# Altium schematic sheet laser_show_adc_uart.SchDoc
size A; Author: FHC
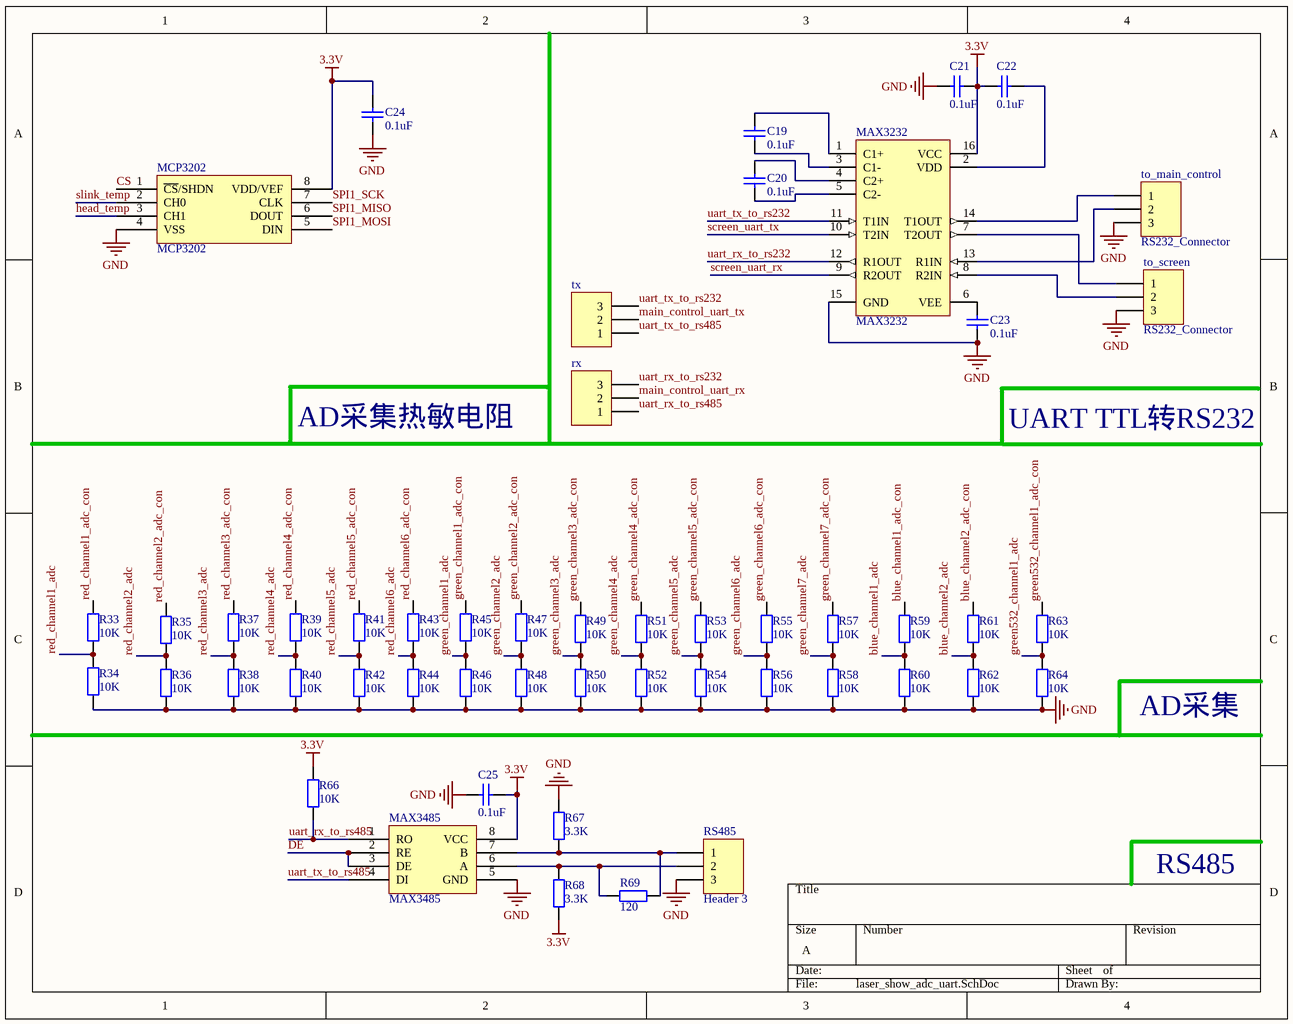
[diagram p0: laser_show_adc_uart.SchDoc]

## Parts
C19  0.1uF  [0603C]
C20  0.1uF  [0603C]
C21  0.1uF  [0603C]
C22  0.1uF  [0603C]
C23  0.1uF  [0603C]
C24  0.1uF  [0603C]
C25  0.1uF  [0603C]
MAX3232  MAX3232  [SO-16]
MAX3485  MAX3485  [so-8]
MCP3202  MCP3202  [SOIC8N_L]
R33  10K  [0805R]
R34  10K  [0805R]
R35  10K  [0805R]
R36  10K  [0805R]
R37  10K  [0805R]
R38  10K  [0805R]
R39  10K  [0805R]
R40  10K  [0805R]
R41  10K  [0805R]
R42  10K  [0805R]
R43  10K  [0805R]
R44  10K  [0805R]
R45  10K  [0805R]
R46  10K  [0805R]
R47  10K  [0805R]
R48  10K  [0805R]
R49  10K  [0805R]
R50  10K  [0805R]
R51  10K  [0805R]
R52  10K  [0805R]
R53  10K  [0805R]
R54  10K  [0805R]
R55  10K  [0805R]
R56  10K  [0805R]
R57  10K  [0805R]
R58  10K  [0805R]
R59  10K  [0805R]
R60  10K  [0805R]
R61  10K  [0805R]
R62  10K  [0805R]
R63  10K  [0805R]
R64  10K  [0805R]
R66  10K  [0603R]
R67  3.3K  [0603R]
R68  3.3K  [0603R]
R69  120  [0603R]
RS485  Header 3  [XH2.54_3P_Vertical]
rx  main  [HDR1X3]  (value not drawn)
to_main_control  RS232_Connector  [XH2.54_3P_Vertical]
to_screen  RS232_Connector  [XH2.54_3P_Vertical]
tx  RS232  [HDR1X3]  (value not drawn)

## Nets
3.3V: C21.1 C22.2 C24.2 C25.1 MAX3232.16(VCC) MAX3485.8(VCC) MCP3202.8(VDD/VEF) R66.2 R68.1
GND: C21.2 C23.1 C24.1 C25.2 MAX3232.15(GND) MAX3485.5(GND) MCP3202.4(VSS) R34.1 R36.1 R38.1 R40.1 R42.1 R44.1 R46.1 R48.1 R50.1 R52.1 R54.1 R56.1 R58.1 R60.1 R62.1 R64.1 R67.2 RS485.3 to_main_control.3 to_screen.3
blue_channel1_adc: R59.1 R60.2
blue_channel1_adc_con: R59.2
blue_channel2_adc: R61.1 R62.2
blue_channel2_adc_con: R61.2
CS: MCP3202.1(~{CS}/SHDN)
DE: MAX3485.2(RE) MAX3485.3(DE)
green532_channel1_adc: R63.1 R64.2
green532_channel1_adc_con: R63.2
green_channel1_adc: R45.1 R46.2
green_channel1_adc_con: R45.2
green_channel2_adc: R47.1 R48.2
green_channel2_adc_con: R47.2
green_channel3_adc: R49.1 R50.2
green_channel3_adc_con: R49.2
green_channel4_adc: R51.1 R52.2
green_channel4_adc_con: R51.2
green_channel5_adc: R53.1 R54.2
green_channel5_adc_con: R53.2
green_channel6_adc: R55.1 R56.2
green_channel6_adc_con: R55.2
green_channel7_adc: R57.1 R58.2
green_channel7_adc_con: R57.2
head_temp: MCP3202.3(CH1)
main_control_uart_rx: rx.2
main_control_uart_tx: tx.2
red_channel1_adc: R33.1 R34.2
red_channel1_adc_con: R33.2
red_channel2_adc: R35.1 R36.2
red_channel2_adc_con: R35.2
red_channel3_adc: R37.1 R38.2
red_channel3_adc_con: R37.2
red_channel4_adc: R39.1 R40.2
red_channel4_adc_con: R39.2
red_channel5_adc: R41.1 R42.2
red_channel5_adc_con: R41.2
red_channel6_adc: R43.1 R44.2
red_channel6_adc_con: R43.2
screen_uart_rx: MAX3232.9(R2OUT)
screen_uart_tx: MAX3232.10(T2IN)
slink_temp: MCP3202.2(CH0)
SPI1_MISO: MCP3202.6(DOUT)
SPI1_MOSI: MCP3202.5(DIN)
SPI1_SCK: MCP3202.7(CLK)
uart_rx_to_rs232: MAX3232.12(R1OUT) rx.3
uart_rx_to_rs485: MAX3485.1(RO) R66.1 rx.1
uart_tx_to_rs232: MAX3232.11(T1IN) tx.3
uart_tx_to_rs485: MAX3485.4(DI) tx.1
NetC19_1: C19.1 MAX3232.3(C1-)
NetC19_2: C19.2 MAX3232.1(C1+)
NetC20_1: C20.1 MAX3232.5(C2-)
NetC20_2: C20.2 MAX3232.4(C2+)
NetC22_1: C22.1 MAX3232.2(VDD)
NetC23_2: C23.2 MAX3232.6(VEE)
NetMAX3232_7: MAX3232.7(T2OUT) to_screen.1
NetMAX3232_8: MAX3232.8(R2IN) to_screen.2
NetMAX3232_13: MAX3232.13(R1IN) to_main_control.2
NetMAX3232_14: MAX3232.14(T1OUT) to_main_control.1
NetMAX3485_6: MAX3485.6(A) R68.2 R69.2 RS485.2
NetMAX3485_7: MAX3485.7(B) R67.1 R69.1 RS485.1

## Notes on the sheet
- AD采集热敏电阻
- UART TTL转RS232
- AD采集
- RS485

## Library data of the parts
C19-C25 = CAP: capacitance
MAX3232 = MAX232: +5V Powered, Multi-Channel RS-232 Driver/Receiver; Published: 16-Jan-2001; LatestRevisionDate: 13-Apr-2006; LatestRevisionNote: IPC-7351 Footprint Added.; PackageReference: NSO16; Publisher: Altium Limited; PackageDescription: 16-Pin Small Outline Integrated Circuit 1.27 mm Pitch; Code_JEDEC: MS-012-AC; Code_IPC: SOIC127P600-16; ComponentLink1Description: Manufacturer Link; ComponentLink1URL: http://www.maxim-ic.com/; ComponentLink2Description: Datasheet; ComponentLink2URL: http://pdfserv.maxim-ic.com/en/ds/MAX220-MAX249.pdf
MAX3485 = MAX485
R33-R64 R66-R69 = RES: resistor
RS485 rx to_main_control to_screen tx = Header 3: Header, 3-Pin; LatestRevisionDate: 17-Jul-2002; LatestRevisionNote: Re-released for DXP Platform.; Publisher: Altium Limited